# Altium schematic sheet Curtain_robot.SchDoc
size A4
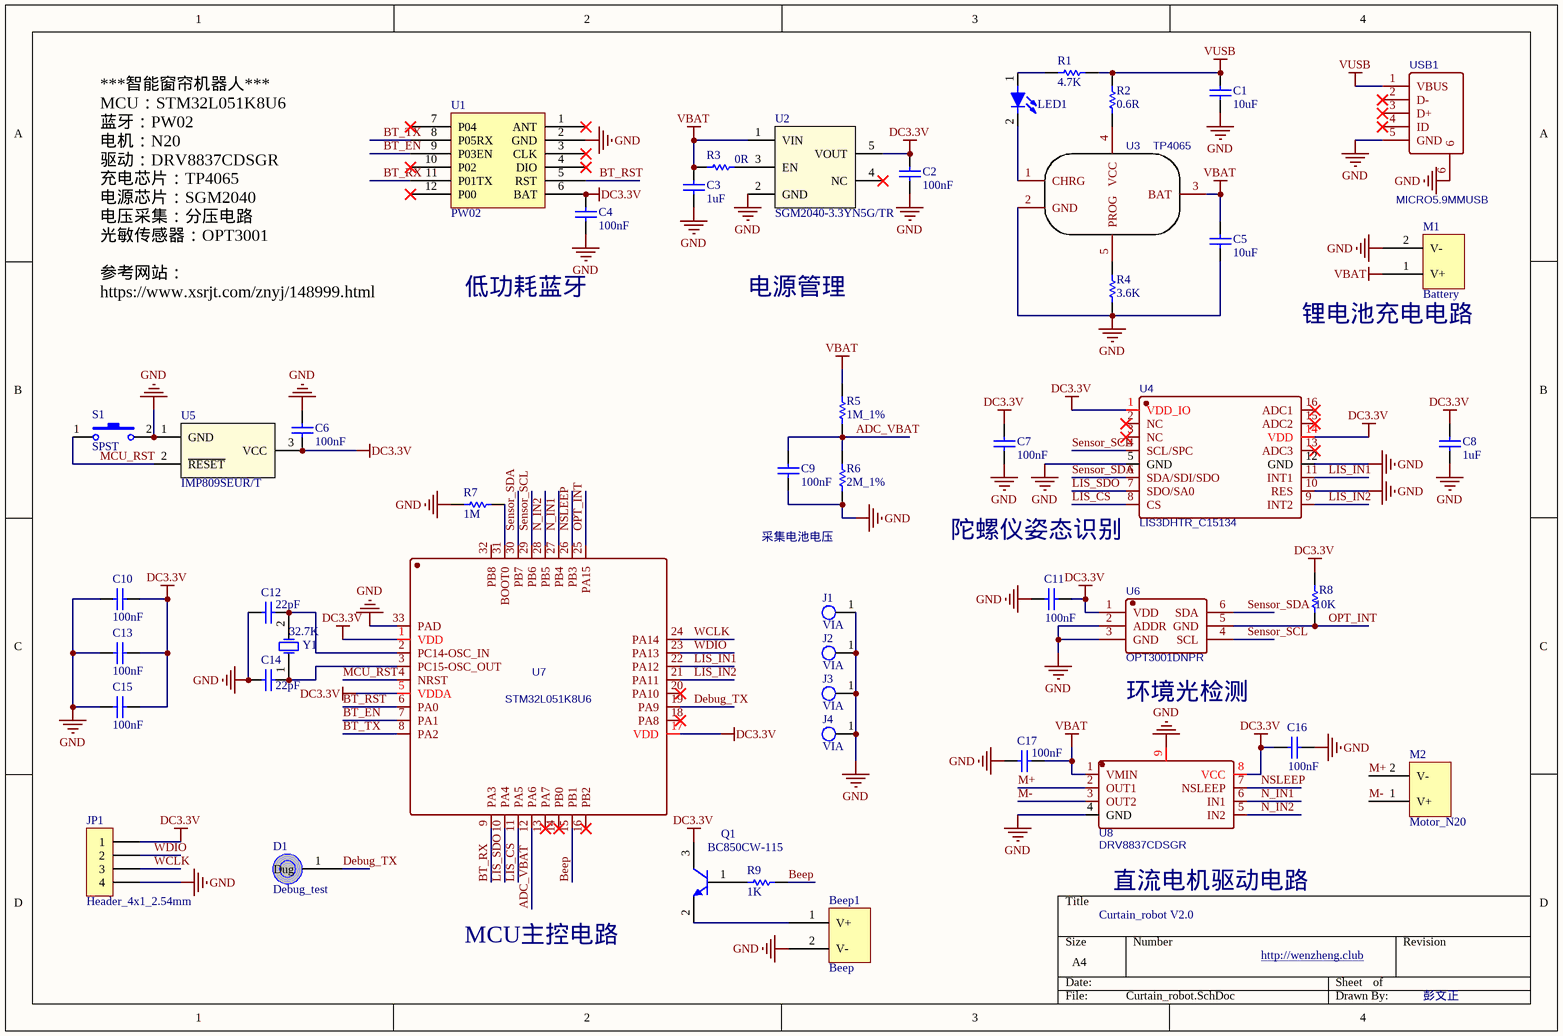
[diagram p0: Curtain_robot.SchDoc]

## Parts
Beep1  Beep  [HDR-TH_2P-P1.27-H-W7.0]
C1  10uF  [C-0603]
C2  100nF  [C0402]
C3  1uF  [C-0603]
C4  100nF  [C0402]
C5  10uF  [C-0603]
C6  100nF  [C0402]
C7  100nF  [C0402]
C8  1uF  [C-0603]
C9  100nF  [C0402]
C10  100nF  [C0402]
C11  100nF  [C0402]
C12  22pF  [C0402]
C13  100nF  [C0402]
C14  22pF  [C0402]
C15  100nF  [C0402]
C16  100nF  [C0402]
C17  100nF  [C0402]
D1  Debug_test  [Debug_Test]
J1  VIA  [via]
J2  VIA  [via]
J3  VIA  [via]
J4  VIA  [via]
JP1  Header_4x1_2.54mm  [usart_jlink]
LED1  LED  [LED0603]  (value not drawn)
M1  Battery  [CONN-TH_P2.50_HX25035-2A]
M2  Motor_N20  [CONN-SMD_1.25-2P]
Q1  BC850CW-115  [SOT-23(SOT-23-3)]
R1  4.7K  [R0402]
R2  0.6R  [R0805]
R3  0R  [R0402]
R4  3.6K  [R0402]
R5  1M_1%  [R0402]
R6  2M_1%  [R0402]
R7  1M  [R0402]
R8  10K  [R0603]
R9  1K  [R0402]
S1  SPST  [KEY]
U1  PW02  [PW02 - duplicate]
U2  SGM2040-3.3YN5G/TR  [SOT-23-5]
U3  TP4065  [SOT-23-5_L3.0-W1.7-P0.95-LS2.8-BL]
U4  LIS3DHTR_C15134  [LGA-16_L3.0-W3.0-P0.50-BL]
U5  IMP809SEUR/T  [SOT-23(SOT-23-3)]
U6  OPT3001DNPR  [USON6_L2.7-W1.8-P0.65-BL-EP]
U7  STM32L051K8U6  [UFQFPN-32_L5.0-W5.0-P0.50-BL-EP]
U8  DRV8837CDSGR  [DRV8837]
USB1  MICRO5.9MMUSB  [MICRO-USB-SMD_5P-P0.65-H-F_MICRO5.9MMUSB]
Y1  32.7K  [FC-135R_L3.2-32.768]

## Nets
DC3.3V: C2.2 C4.1 C6.1 C7.2 C8.2 C10.2 C11.1 C13.2 C15.2 C16.2 JP1.1 Q1.3(C) R8.2 U1.6(BAT) U2.5(VOUT) U4.1(VDD_IO) U4.14(VDD) U5.3(VCC) U6.1(VDD) U7.1(VDD) U7.5(VDDA) U7.17(VDD) U8.8(VCC)
GND: Beep1.2(V-) C1.1 C2.1 C3.1 C4.2 C5.1 C6.2 C7.1 C8.1 C9.1 C10.1 C11.2 C12.2 C13.1 C14.2 C15.1 C16.1 C17.2 J1.1(GND) J2.1(GND) J3.1(GND) J4.1(GND) JP1.4 M1.2(V-) R4.1 R6.2 R7.2 S1.2 U1.2(GND) U2.2(GND) U3.2(GND) U4.5(GND) U4.10(RES) U4.12(GND) U5.1(GND) U6.2(ADDR) U6.3(GND) U7.33(PAD) U8.4(GND) U8.9(PAD) USB1.5(GND) USB1.6
VBAT: C3.2 C5.2 C17.1 M1.1(V+) R3.1 R5.1 U2.1(VIN) U3.3(BAT) U8.1(VMIN)
VUSB: C1.2 R1.1 R2.2 USB1.1(VBUS)
ADC_VBAT: C9.2 R5.2 R6.1 U7.12(PA6)
Beep: R9.1 U7.15(PB1)
BT_EN: U1.9(P03EN) U7.7(PA1)
BT_RST: U1.5(RST) U7.6(PA0)
BT_RX: U1.11(P01TX) U7.9(PA3)
BT_TX: U1.8(P05RX) U7.8(PA2)
Debug_TX: D1.1(Dug) U7.19(PA9)
LIS_CS: U4.8(CS) U7.11(PA5)
LIS_IN1: U4.11(INT1) U7.22(PA12)
LIS_IN2: U4.9(INT2) U7.21(PA11)
LIS_SDO: U4.7(SDO/SA0) U7.10(PA4)
M+: M2.2(V-) U8.2(OUT1)
M-: M2.1(V+) U8.3(OUT2)
MCU_RST: S1.1 U5.2(~{RESET}) U7.4(NRST)
N_IN1: U7.27(PB4) U8.6(IN1)
N_IN2: U7.28(PB5) U8.5(IN2)
NSLEEP: U7.26(PB3) U8.7(NSLEEP)
OPT_INT: R8.1 U6.5(GND) U7.25(PA15)
Sensor_SCL: U4.4(SCL/SPC) U6.4(SCL) U7.29(PB6)
Sensor_SDA: U4.6(SDA/SDI/SDO) U6.6(SDA) U7.30(PB7)
WCLK: JP1.3 U7.24(PA14)
WDIO: JP1.2 U7.23(PA13)
NetBeep1_1: Beep1.1(V+) Q1.2(E)
NetC12_1: C12.1 U7.2(PC14-OSC_IN) Y1.2(OSC2)
NetC14_1: C14.1 U7.3(PC15-OSC_OUT) Y1.1(OSC1)
NetLED1_1: LED1.1 R1.2
NetLED1_2: LED1.2 U3.1(CHRG)
NetQ1_1: Q1.1(B) R9.2
NetR2_1: R2.1 U3.4(VCC)
NetR3_2: R3.2 U2.3(EN)
NetR4_2: R4.2 U3.5(PROG)
NetR7_1: R7.1 U7.31(BOOT0)

Not connected (* = marked no-connect by the designer): U1 1(ANT)* 3(CLK)* 4(DIO)* 7(P04)* 10(P02)* 12(P00)*; U2 4(NC)*; U4 2(NC)* 3(NC)* 13(ADC3)* 15(ADC2)* 16(ADC1)*; U7 13(PA7)* 14(PB0)* 16(PB2)* 18(PA8)* 20(PA10)* 32(PB8); USB1 2(D-)* 3(D+)* 4(ID)*

## Notes on the sheet
- ***智能窗帘机器人***
  MCU：STM32L051K8U6
  蓝牙：PW02
  电机：N20
  驱动：DRV8837CDSGR
  充电芯片：TP4065
  电源芯片：SGM2040
  电压采集：分压电路
  光敏传感器：OPT3001
  参考网站：https://www.xsrjt.com/znyj/148999.html
- 低功耗蓝牙
- 电源管理
- (near M1) 锂电池充电电路
- 采集电池电压
- 陀螺仪姿态识别
- 环境光检测
- Curtain_robot V2.0
- 直流电机驱动电路
- MCU主控电路
- http://wenzheng.club
- 彭文正

## Library data of the parts
Beep1 M1 = Motor_N20
C1-C8 C10-C17 = Cap
C9 = C
J1-J4 = VIA: 安装孔
LED1 = LED: FC-DA1608HGK-572C
Q1 = BC850CW-115: NPN
R1-R4 R7-R9 = Res: Resistor
R5 R6 = R: Resistor
U2 = SGM2040-3.3YN5G/TR: IC_LDO_3.3V_250mA_5P_SOT-23-5; Manufacture: SGMICRO; Manufacture part number: SGM2040-3.3YN5G/TR
U3 = TP4065: BOM_Manufacturer: TOPPOWER; SMT Type: Extend; BOM_Supplier: LCSC; BOM_Manufacturer Part: TP4065; BOM_Supplier Part: C113540; BOM_LCSC Assembly: Yes; spicePre: U; spiceSymbolName: TP4065
U4 = LIS3DHTR_C15134: BOM_Manufacturer: STMicroelectronics; SMT Type: Extend; BOM_Supplier: LCSC; BOM_Manufacturer Part: LIS3DHTR; image: //image.lceda.cn/szlcsc/C15134.jpg; BOM_Supplier Part: C15134; BOM_LCSC Assembly: Yes; spicePre: U; spiceSymbolName: LIS3DHTR_C15134
U5 = IMP809SEUR/T: MCU监控芯片-2.93V
U6 = OPT3001DNPR: BOM_Manufacturer: TI; SMT Type: Extend; BOM_Supplier: LCSC; BOM_Manufacturer Part: OPT3001DNPR; BOM_Supplier Part: C90462; BOM_LCSC Assembly: Yes; spicePre: U; spiceSymbolName: OPT3001DNPR
U7 = STM32L051K8U6: BOM_Manufacturer: STMicroelectronics; SMT Type: Extend; BOM_Supplier: LCSC; BOM_Manufacturer Part: STM32L051K8U6; BOM_Supplier Part: C94770; BOM_LCSC Assembly: Yes; spicePre: U; spiceSymbolName: STM32L051K8U6
U8 = DRV8837CDSGR: BOM_Manufacturer: Texas Instruments; Contributor: LCSC; SMT Type: Extend; BOM_Supplier: LCSC; BOM_Supplier Part: C191000; BOM_Manufacturer Part: DRV8837CDSGR; BOM_LCSC Assembly: Yes; spicePre: U; spiceSymbolName: DRV8837CDSGR
USB1 = MICRO5.9MMUSB: BOM_Manufacturer: SHOU HAN; Contributor: LCSC; BOM_Supplier: LCSC; BOM_Supplier Part: C393940; BOM_Manufacturer Part: MICRO5.9mmusb; spicePre: U; spiceSymbolName: MICRO5.9MMUSB
Y1 = 32.768K_CRYSTAL: 32.768K Crystal Oscillator; Published: 8-Jun-2000; LatestRevisionDate: 17-Jul-2002; LatestRevisionNote: Re-released for DXP Platform.; PackageReference: R38; Publisher: Altium Limited; PackageDescription: Crystal, Thru-Hole; 2 Leads; Body 3.1 x 8.2 mm (Dia.xH)